# Altium schematic sheet Processor.SchDoc
size A4; SheetNumber: 3; SheetTotal: 3
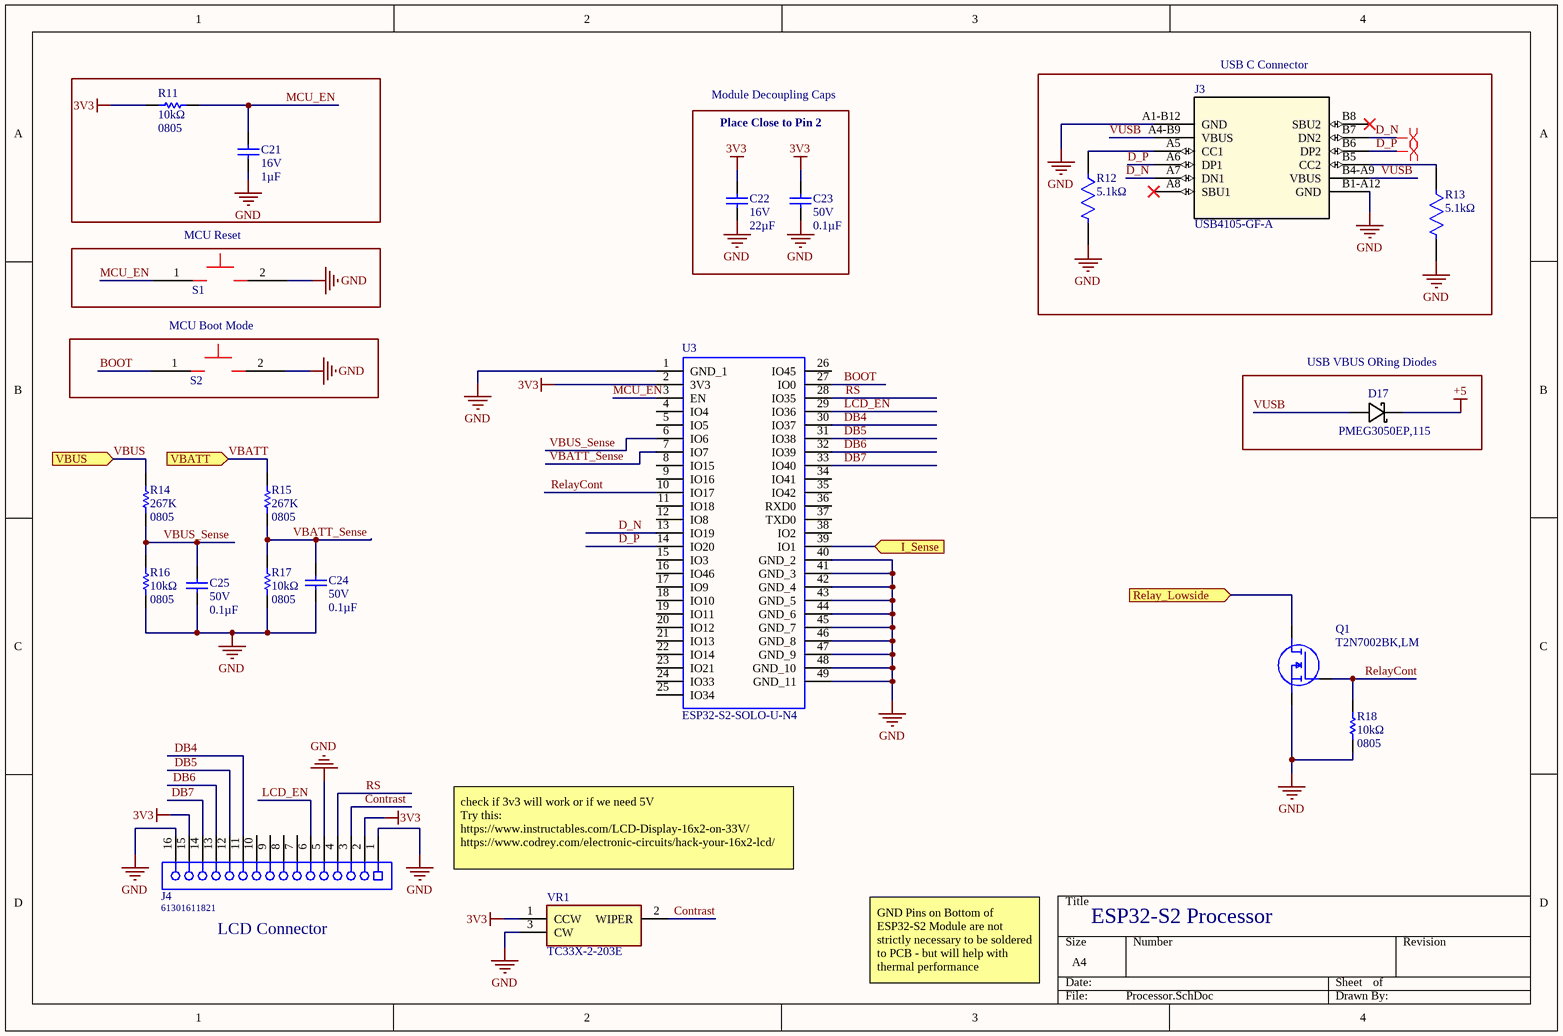
[diagram p0: Processor.SchDoc]

## Parts
C21  Voltage - Rated: 16V  Capacitance: 1µF  [CAP0805]  (hidden comment: GRM21BR71C105KA01L)
C22  Voltage - Rated: 16V  Capacitance: 22µF  [CAP0805]  (hidden comment: CL21A226MOCLRNC)
C23  Voltage - Rated: 50V  Capacitance: 0.1µF  [CAP0805]  (hidden comment: C0805C104K5RACTU)
C24  Voltage - Rated: 50V  Capacitance: 0.1µF  [CAP0805]  (hidden comment: C0805C104K5RACTU)
C25  Voltage - Rated: 50V  Capacitance: 0.1µF  [CAP0805]  (hidden comment: C0805C104K5RACTU)
D17  MFG_PN: PMEG3050EP,115  [SOD-128]  (hidden comment: D_PMEG3050EP,115)
J3  USB4105-GF-A  [USB4105_GCT]
J4  61301611821  [61301611821]
Q1  T2N7002BK,LM  [TBAT54CLM]
R11  Resistance: 10kΩ  Package / Case: 0805  [RES0805]  (hidden comment: RC0805FR-0710KL)
R12  Resistance: 5.1kΩ  [FP-CRCW0805-e3-MFG]  (hidden comment: CRCW08055K10FKEA)
R13  Resistance: 5.1kΩ  [FP-CRCW0805-e3-MFG]  (hidden comment: CRCW08055K10FKEA)
R14  Resistance: 267K  Package: 0805  [RESC2013X60X35NL10T20]  (hidden comment: RC0805FR-07267KL)
R15  Resistance: 267K  Package: 0805  [RESC2013X60X35NL10T20]  (hidden comment: RC0805FR-07267KL)
R16  Resistance: 10kΩ  Package / Case: 0805  [RES0805]  (hidden comment: RC0805FR-0710KL)
R17  Resistance: 10kΩ  Package / Case: 0805  [RES0805]  (hidden comment: RC0805FR-0710KL)
R18  Resistance: 10kΩ  Package / Case: 0805  [RES0805]  (hidden comment: RC0805FR-0710KL)
S1  RESET  [Tactile_Button_3X6X2]  (value not drawn)
S2  BOOT  [Tactile_Button_3X6X2]  (value not drawn)
U3  ESP32-S2-SOLO-U-N4  [ESP32S2SOLOUN4]
VR1  TC33X-2-203E  [TC33X2503E]

## Blocks framed on the sheet
USB C Connector: J3 R12 R13
MCU Reset: S1
MCU Boot Mode: S2
USB VBUS ORing Diodes: D17

## Ports
I_Sense (in), Relay_Lowside (in), VBATT (in), VBUS (in)

## Nets
3V3: C22.2 C23.2 J4.2 J4.15 R11.2 U3.2(3V3) VR1.1(CCW)
+5: D17.2
GND: C21.1 C22.1 C23.1 C24.1 C25.1 J3.A1-B12(GND) J3.B1-A12(GND) J4.1 J4.5 J4.16 Q1.2(S) R12.2 R13.2 R16.2 R17.1 R18.1 S1.2 S2.2 U3.1(GND_1) U3.40(GND_2) U3.41(GND_3) U3.42(GND_4) U3.43(GND_5) U3.44(GND_6) U3.45(GND_7) U3.46(GND_8) U3.47(GND_9) U3.48(GND_10) U3.49(GND_11) VR1.3(CW)
BOOT: S2.1 U3.27(IO0)
Contrast: J4.3 VR1.2(WIPER)
D_N: J3.A7(DN1) J3.B7(DN2) U3.13(IO19)
D_P: J3.A6(DP1) J3.B6(DP2) U3.14(IO20)
DB4: J4.11 U3.30(IO37)
DB5: J4.12 U3.31(IO38)
DB6: J4.13 U3.32(IO39)
DB7: J4.14 U3.33(IO40)
I_Sense: U3.39(IO1) ; port I_Sense
LCD_EN: J4.6 U3.29(IO36)
MCU_EN: C21.2 R11.1 S1.1 U3.3(EN)
Relay_Lowside: Q1.3(D) ; port Relay_Lowside
RelayCont: Q1.1(G) R18.2 U3.10(IO17)
RS: J4.4 U3.28(IO35)
VBATT: R15.2 ; port VBATT
VBATT_Sense: C24.2 R15.1 R17.2 U3.7(IO7)
VBUS: R14.2 ; port VBUS
VBUS_Sense: C25.2 R14.1 R16.1 U3.6(IO6)
VUSB: D17.1 J3.A4-B9(VBUS) J3.B4-A9(VBUS)
NetJ3_A5: J3.A5(CC1) R12.1
NetJ3_B5: J3.B5(CC2) R13.1

Not connected (* = marked no-connect by the designer): J3 A8(SBU1)* B8(SBU2)*; J4 7 8 9 10; U3 4(IO4) 5(IO5) 8(IO15) 9(IO16) 11(IO18) 12(IO8) 15(IO3) 16(IO46) 17(IO9) 18(IO10) 19(IO11) 20(IO12) 21(IO13) 22(IO14) 23(IO21) 24(IO33) 25(IO34) 26(IO45) 34(IO41) 35(IO42) 36(RXD0) 37(TXD0) 38(IO2)

## Layout directives
differential pair: D_N, D_P

## Notes on the sheet
- Module Decoupling Caps
- Place Close to Pin 2
- check if 3v3 will work or if we need 5V
  Try this:
  https://www.instructables.com/LCD-Display-16x2-on-33V/
  https://www.codrey.com/electronic-circuits/hack-your-16x2-lcd/
- ESP32-S2 Processor
- LCD Connector
- GND Pins on Bottom of ESP32-S2 Module are not strictly necessary to be soldered to PCB - but will help with thermal performance

## Library data of the parts
C21 = GRM21BR71C105KA01L: CAP CER 1UF 16V X7R 0805; Manufacturer: Murata Electronics North America; Tolerance: ±10%; Temperature Coefficient: X7R; Operating Temperature: -55°C ~ 125°C; Supplier 1: Digi-Key; Supplier Part Number 1: 490-1691-1-ND; Package / Case: 0805
C22 = CL21A226MOCLRNC: CAP CER 22UF 16V X5R 0805; Tolerance: ±20%; Supplier 1: Digi-Key; Supplier Part Number 1: 1276-6780-1-ND; Temperature Coefficient: X5R; Footprint: 0805
C23-C25 = C0805C104K5RACTU: CAP CER 0.1UF 50V X7R 0805; Tolerance: ±10%; Supplier 1: Digi-Key; Supplier Part Number 1: 399-1170-1-ND; Temperature Coefficient: X7R; Package / Case: 0805
D17 = D_PMEG3050EP,115: DIODE SCHOTTKY 360mV 30V 5A; MFG: Nexperia; Supplier: Digikey; Supplier_PN: 1727-5317-1-ND
J3 = USB4105-GF-A: No Description Available; Mfr_Name: Global Connector Technology; Copyright: Copyright (C) 2022 Ultra Librarian. All rights reserved.; Manufacturer_Part_Number: USB4105-GF-A; Digi-Key_Part_Number_1: 2073-USB4105-GF-ACT-ND; Digi-Key_Part_Number_2: 2073-USB4105-GF-ADKR-ND; Digi-Key_Part_Number_3: 2073-USB4105-GF-ATR-ND; RefDes: RefDes; Type: DEV
J4 = CMP-1502-01343-1: THT Vertical Socket Header WR-PHD, Pitch 2.54 mm, Single Row, 16 pins; Manufacturer: Wurth Elektronik; Working Voltage: 250VAC; Pin Number: 16; Gender: Female; Withstanding Voltage: 500VAC; Rated Current: 3A; Contact Resistance: 20mOhm; Pitch: 2.54mm; Operating Temperature: -40to125degC; Manufacturer URL: http://www.we-online.de; Mounting Technology: THT; Part Number: 61301611821; Datasheet URL: https://katalog.we-online.de/em/datasheet/6130xx11821.pdf; Publisher: WurthElektronik; Row Number: Single; Orientation: Vertical; Packaging: Tray; Package Reference: 61301611821
Q1 = T2N7002BK,LM: MOSFET (N-Channel); Manufacturer_Name: Toshiba; Datasheet Link: https://toshiba.semicon-storage.com/info/docget.jsp?did=30376&prodName=T2N7002BK; Height: 1.1mm; Manufacturer_Part_Number: T2N7002BK,LM; Mouser Part Number: 757-T2N7002BKLM; Mouser Price/Stock: https://www.mouser.co.uk/ProductDetail/Toshiba/T2N7002BKLM?qs=lX6dEUlT%252BgfTnU11z%2FTylg%3D%3D; Arrow Part Number: T2N7002BK,LM; Arrow Price/Stock: https://www.arrow.com/en/products/t2n7002bklm/toshiba?region=nac
R11 R16-R18 = RC0805FR-0710KL: RES SMD 10K OHM 1% 1/8W 0805; Manufacturer: Yageo; Power (Watts): 0.125W, 1/8W; Temperature Coefficient: ±100ppm/°C; Supplier 1: Digi-Key; Supplier Part Number 1: 311-10.0KCRCT-ND; Tolerance: ±1%; Composition: Thick Film; Features: Moisture Resistant; Operating Temperature: -55°C ~ 155°C
R12 R13 = CMP-2001-04024-2: RES Thick Film, 5.1kΩ, 1%, 0.125W, 100ppm/°C, 0805; Power Rating: 125mW; Voltage Rating (DC): 150V; Packaging: Tape and Reel; Case Code (Metric): 2012; Contact Plating: Tin; Case Code (Imperial): 0805; Depth: 1.25mm; Tolerance: 1%; Width: 0.049inch; Temperature Coefficient: 100ppm/°C; Max Power Dissipation: 125mW; Military Standard: Not; Lead Free: Lead Free; Mount: Surface Mount; Min Operating Temperature: -55°C; Package Quantity: 10; Weight: 0.000194oz; Height: 0.45mm; Number of Terminations: 2; Max Operating Temperature: 155°C; Termination: SMD/SMT; Case/Package: 0805; Composition: Thick Film; Voltage Rating: 150V; Length: 2mm; Features: Automotive AEC-Q200; Radiation Hardening: No
R14 R15 = CMP-2001-01033-1: Manufacturer: Yageo; Part Number: RC0805FR-07267KL
S1 S2 = Tactile Button_3X6X2
U3 = ESP32-S2-SOLO-U-N4: WiFi Modules - 802.11 SMD module, ESP32-S2, 4 MB SPI flash, IPEX antenna; Manufacturer_Name: Espressif Systems; Geometry.Height: 3.35mm; Mouser Part Number: 356-ESP32-S2-SOLOUN4; Mouser Price/Stock: https://www.mouser.co.uk/ProductDetail/Espressif-Systems/ESP32-S2-SOLO-U-N4?qs=pBJMDPsKWf24meOzbFo%252B2g%3D%3D; Manufacturer_Part_Number: ESP32-S2-SOLO-U-N4; Datasheet Link: https://www.espressif.com/sites/default/files/documentation/esp32-s2-solo_esp32-s2-solo-u_datasheet_en.pdf
VR1 = TC33X-2-203E: Variable Resistor; Manufacturer_Name: Bourns; Datasheet Link: https://www.bourns.com/pdfs/TC33.pdf; Height: 1.2mm; Manufacturer_Part_Number: TC33X-2-203E; Mouser Part Number: 652-TC33X-2-203E; Mouser Price/Stock: https://www.mouser.co.uk/ProductDetail/Bourns/TC33X-2-203E?qs=kSSonJSvPGoOcNyKSIM%252Bog%3D%3D; Arrow Part Number: TC33X-2-203E; Arrow Price/Stock: https://www.arrow.com/en/products/tc33x-2-203e/bourns?region=nac